# Altium project SL-DPT100.PrjPcb
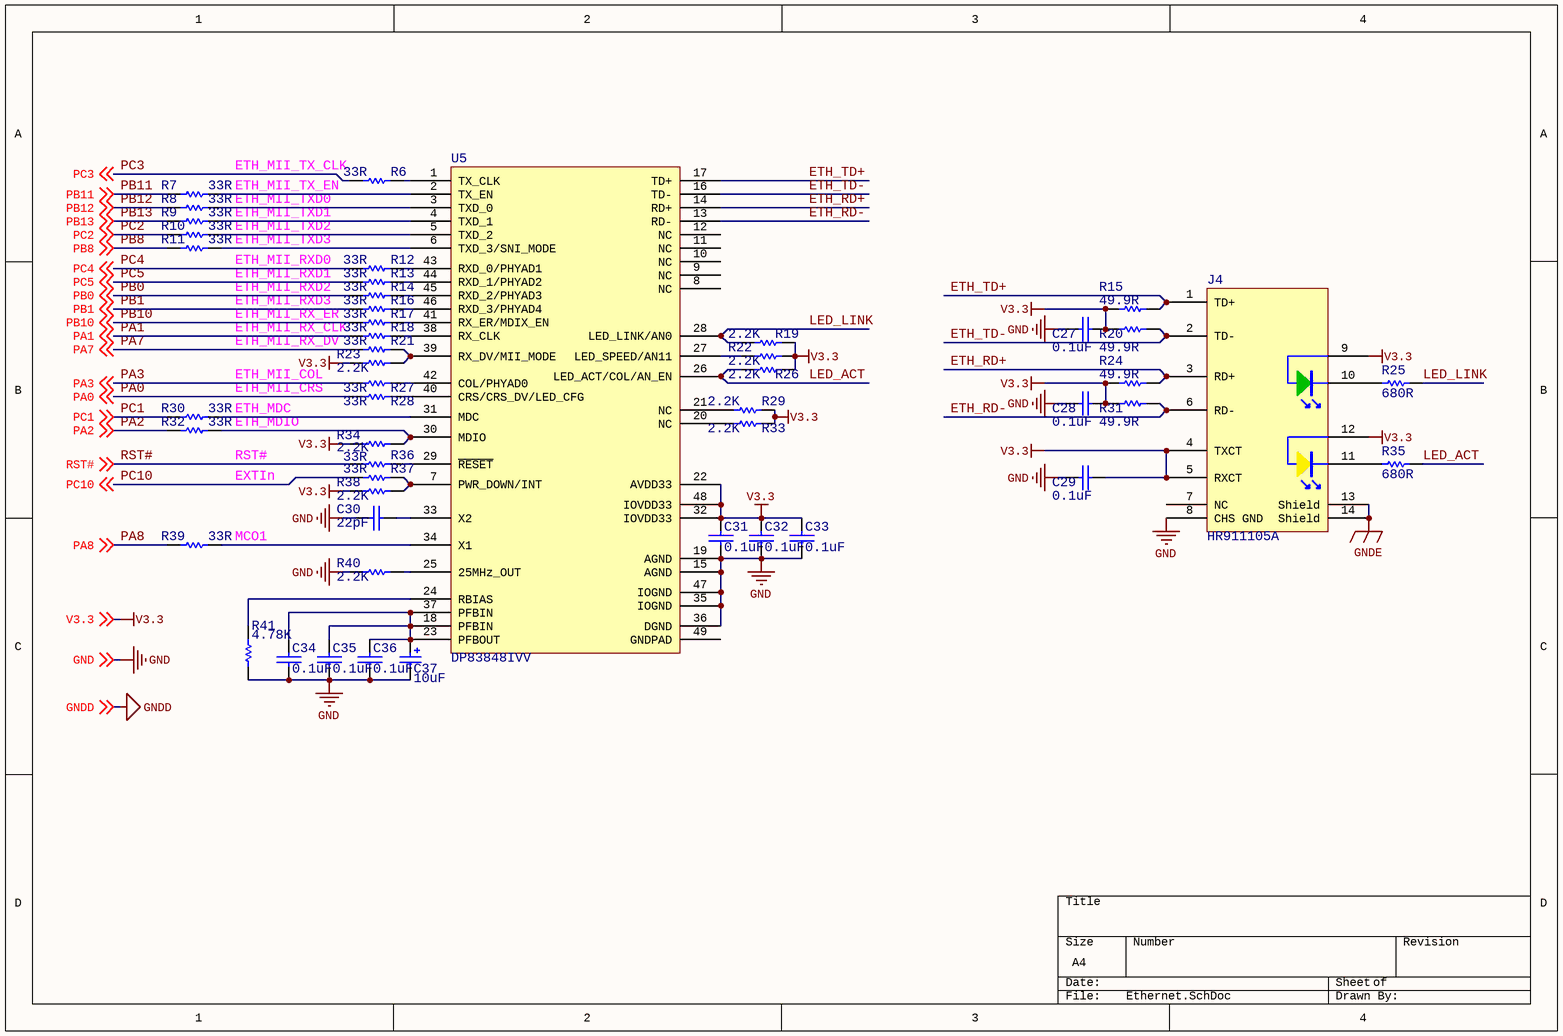
[diagram p0: Ethernet.SchDoc]
4 sheets, 177 parts. Net scope: global (net labels, ports and power ports of the same name join across sheets).
Board files: SL-DPT100.PcbDoc, Phoenix ME MAX 22.5 2-2 KMGY.PcbDoc
Sheets:
  Ethernet.SchDoc
  MCU.SchDoc
  MCU_1.SchDoc
  Power.SchDoc

## Sheet Ethernet.SchDoc
size A4; PageSetup: Record=PageOptions|CenterHorizontal=True|CenterVertical=True|PrintScale=0.98|XCorrection=1.00|YCorrection=1.00|PrintKind=0|BorderSize=5000000|LeftOffset=0|BottomOffset=0|Orientation=2|PaperLength=1000|PaperWidth=1000|Scale=100|PaperSource=7|PrintQuality=-4|MediaType=1|DitherType=10|PaperKind=A4 210x297 ºÁÃ×|PrintScaleMode=1

### Parts
C27  0.1uF  [C1608(0603)]
C28  0.1uF  [C1608(0603)]
C29  0.1uF  [C1608(0603)]
C30  22pF  [C1608(0603)]
C31  0.1uF  [C1608(0603)]
C32  0.1uF  [C1608(0603)]
C33  0.1uF  [C1608(0603)]
C34  0.1uF  [C1608(0603)]
C35  0.1uF  [C1608(0603)]
C36  0.1uF  [C1608(0603)]
C37  10uF  [C2012(0805)]
J4  HR911105A  [RJ45-LED]
R6  33R  [R1608(0603)]
R7  33R  [R1608(0603)]
R8  33R  [R1608(0603)]
R9  33R  [R1608(0603)]
R10  33R  [R1608(0603)]
R11  33R  [R1608(0603)]
R12  33R  [R1608(0603)]
R13  33R  [R1608(0603)]
R14  33R  [R1608(0603)]
R15  49.9R  [R1608(0603)]
R16  33R  [R1608(0603)]
R17  33R  [R1608(0603)]
R18  33R  [R1608(0603)]
R19  2.2K  [R1608(0603)]
R20  49.9R  [R1608(0603)]
R21  33R  [R1608(0603)]
R22  2.2K  [R1608(0603)]
R23  2.2K  [R1608(0603)]
R24  49.9R  [R1608(0603)]
R25  680R  [R1608(0603)]
R26  2.2K  [R1608(0603)]
R27  33R  [R1608(0603)]
R28  33R  [R1608(0603)]
R29  2.2K  [R1608(0603)]
R30  33R  [R1608(0603)]
R31  49.9R  [R1608(0603)]
R32  33R  [R1608(0603)]
R33  2.2K  [R1608(0603)]
R34  2.2K  [R1608(0603)]
R35  680R  [R1608(0603)]
R36  33R  [R1608(0603)]
R37  33R  [R1608(0603)]
R38  2.2K  [R1608(0603)]
R39  33R  [R1608(0603)]
R40  2.2K  [R1608(0603)]
R41  4.78K  [R1608(0603)]
U5  DP83848IVV  [LQFP48_M]

### Nets
GND: C27.2 C28.2 C29.2 C30.1 C31.1 C32.1 C33.1 C34.1 C35.1 C36.1 C37.2 J4.8(CHS_GND) R40.2 R41.2 U5.15(AGND) U5.19(AGND) U5.35(IOGND) U5.36(DGND) U5.47(IOGND) ; off-sheet GND
GNDE: J4.13(Shield) J4.14(Shield)
V3.3: C27.1 C28.1 C29.1 C31.2 C32.2 C33.2 J4.4(TXCT) J4.5(RXCT) J4.9 J4.12 R15.2 R19.1 R20.2 R22.1 R23.2 R24.2 R26.1 R29.1 R31.2 R33.1 R34.2 R38.2 U5.22(AVDD33) U5.32(IOVDD33) U5.48(IOVDD33) ; off-sheet V3.3
ETH_RD+: J4.3(RD+) R24.1 U5.14(RD+)
ETH_RD-: J4.6(RD-) R31.1 U5.13(RD-)
ETH_TD+: J4.1(TD+) R15.1 U5.17(TD+)
ETH_TD-: J4.2(TD-) R20.1 U5.16(TD-)
LED_ACT: R26.2 R35.2 U5.26(LED_ACT/COL/AN_EN)
LED_LINK: R19.2 R25.2 U5.28(LED_LINK/AN0)
PA0: R28.2 ; off-sheet PA0
PA1: R18.2 ; off-sheet PA1
PA2: R32.2 ; off-sheet PA2
PA3: R27.2 ; off-sheet PA3
PA7: R21.2 ; off-sheet PA7
PA8: R39.2 ; off-sheet PA8
PB0: R14.2 ; off-sheet PB0
PB1: R16.2 ; off-sheet PB1
PB8: R11.2 ; off-sheet PB8
PB10: R17.2 ; off-sheet PB10
PB11: R7.2 ; off-sheet PB11
PB12: R8.2 ; off-sheet PB12
PB13: R9.2 ; off-sheet PB13
PC1: R30.2 ; off-sheet PC1
PC2: R10.2 ; off-sheet PC2
PC3: R6.2 ; off-sheet PC3
PC4: R12.2 ; off-sheet PC4
PC5: R13.2 ; off-sheet PC5
PC10: R37.2 ; off-sheet PC10
RST#: R36.2 ; off-sheet RST#
NetC30_2: C30.2 U5.33(X2)
NetC34_2: C34.2 C35.2 C36.2 C37.1 U5.18(PFBIN) U5.23(PFBOUT) U5.37(PFBIN)
NetJ4_10: J4.10 R25.1
NetJ4_11: J4.11 R35.1
NetR6_1: R6.1 U5.1(TX_CLK)
NetR7_1: R7.1 U5.2(TX_EN)
NetR8_1: R8.1 U5.3(TXD_0)
NetR9_1: R9.1 U5.4(TXD_1)
NetR10_1: R10.1 U5.5(TXD_2)
NetR11_1: R11.1 U5.6(TXD_3/SNI_MODE)
NetR12_1: R12.1 U5.43(RXD_0/PHYAD1)
NetR13_1: R13.1 U5.44(RXD_1/PHYAD2)
NetR14_1: R14.1 U5.45(RXD_2/PHYAD3)
NetR16_1: R16.1 U5.46(RXD_3/PHYAD4)
NetR17_1: R17.1 U5.41(RX_ER/MDIX_EN)
NetR18_1: R18.1 U5.38(RX_CLK)
NetR21_1: R21.1 R23.1 U5.39(RX_DV/MII_MODE)
NetR22_2: R22.2 U5.27(LED_SPEED/AN11)
NetR27_1: R27.1 U5.42(COL/PHYAD0)
NetR28_1: R28.1 U5.40(CRS/CRS_DV/LED_CFG)
NetR29_2: R29.2 U5.21(NC)
NetR30_1: R30.1 U5.31(MDC)
NetR32_1: R32.1 R34.1 U5.30(MDIO)
NetR33_2: R33.2 U5.20(NC)
NetR36_1: R36.1 U5.29(~{RESET})
NetR37_1: R37.1 R38.1 U5.7(PWR_DOWN/INT)
NetR39_1: R39.1 U5.34(X1)
NetR40_1: R40.1 U5.25(25MHz_OUT)
NetR41_1: R41.1 U5.24(RBIAS)

Not connected (* = marked no-connect by the designer): J4 7(NC); U5 8(NC) 9(NC) 10(NC) 11(NC) 12(NC) 49(GNDPAD)

### Notes on the sheet
- ETH_MII_TX_CLK
- ETH_MII_TX_EN
- ETH_MII_TXD0
- ETH_MII_TXD1
- ETH_MII_TXD2
- ETH_MII_TXD3
- ETH_MII_RXD0
- ETH_MII_RXD1
- ETH_MII_RXD2
- ETH_MII_RXD3
- ETH_MII_RX_ER
- ETH_MII_RX_DV
- ETH_MII_RX_CLK
- ETH_MII_COL
- ETH_MII_CRS
- ETH_MDC
- ETH_MDIO
- RST#
- EXTIn
- (near R39) MCO1

### Library data of the parts
C27-C36 = CAP: Capacitor
C37 = Cap Pol2: Polarized Capacitor (Axial); Value: 100pF/100V; Published: 8-Jun-2000; LatestRevisionDate: 17-Jul-2002; LatestRevisionNote: Re-released for DXP Platform.; PackageReference: POLAR0.8; Publisher: Altium Limited
R6-R41 = Res Semi: Semiconductor Resistor; Value: 1K; Published: 8-Jun-2000; LatestRevisionDate: 17-Jul-2002; LatestRevisionNote: Re-released for DXP Platform.; PackageReference: AXIAL-0.5; Publisher: Altium Limited
U5 = DP83848CVV

## Sheet MCU.SchDoc
size A4; PageSetup: Record=PageOptions|CenterHorizontal=True|CenterVertical=True|PrintScale=0.98|XCorrection=1.00|YCorrection=1.00|PrintKind=0|BorderSize=5000000|LeftOffset=0|BottomOffset=0|Orientation=2|PaperLength=1000|PaperWidth=1000|Scale=100|PaperSource=7|PrintQuality=-4|MediaType=1|DitherType=10|PaperKind=A4 210x297 ºÁÃ×|PrintScaleMode=1
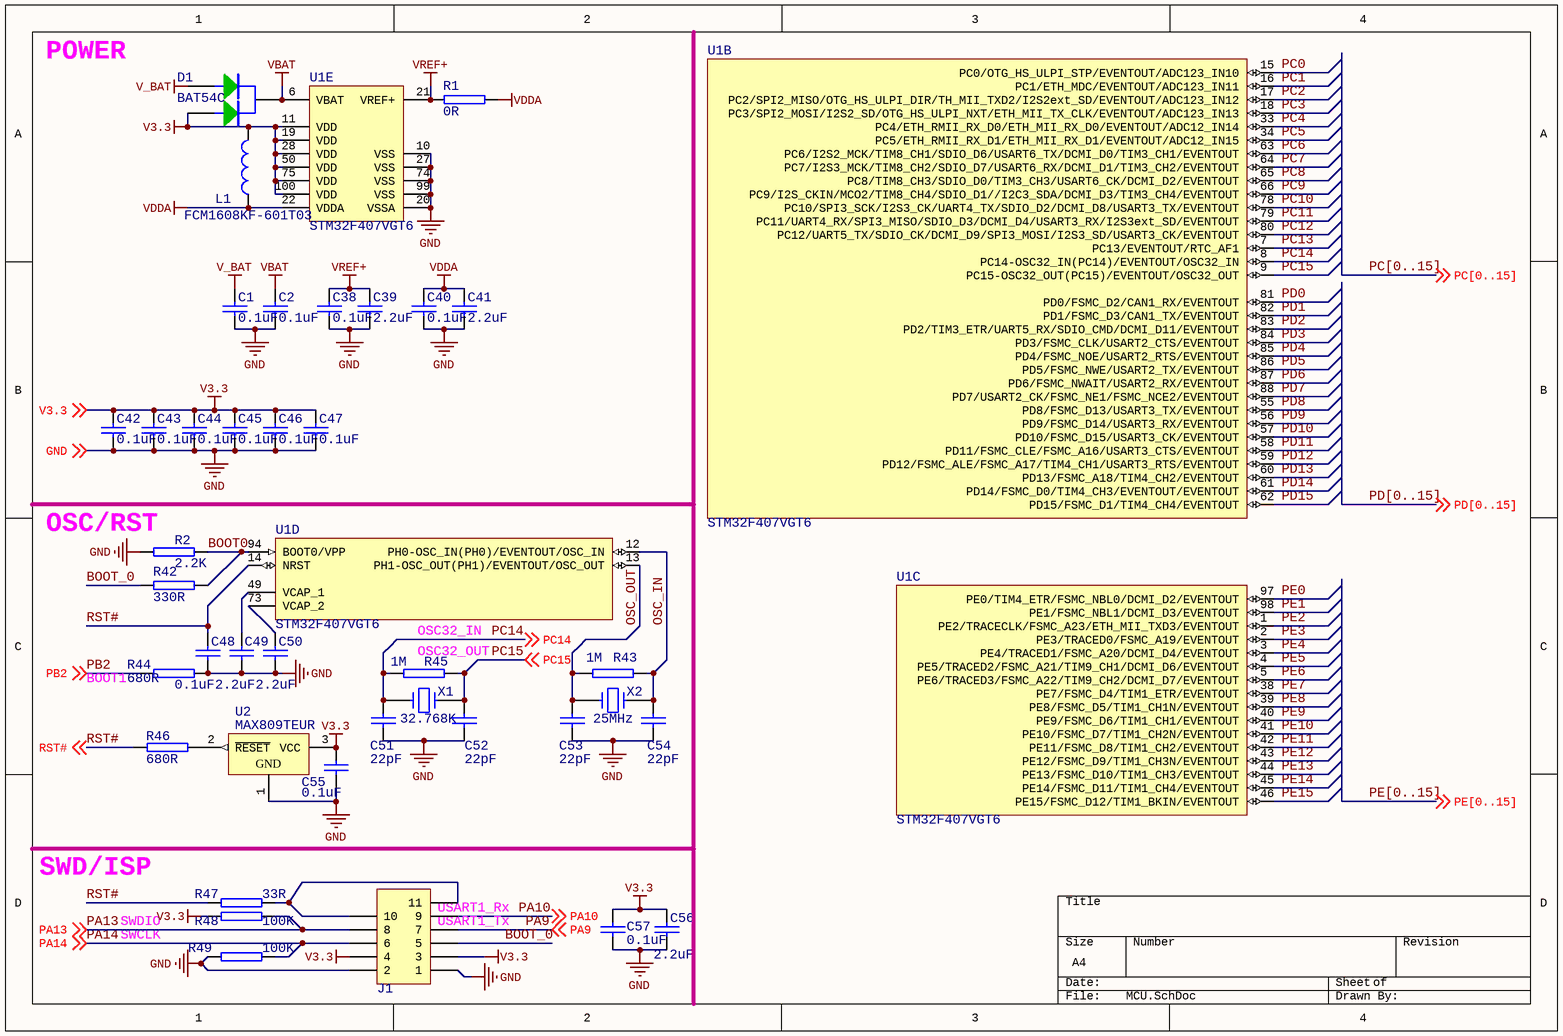
[diagram p1: MCU.SchDoc]

### Parts
C1  0.1uF  [C1608(0603)]
C2  0.1uF  [C1608(0603)]
C38  0.1uF  [C1608(0603)]
C39  2.2uF  [C1608(0603)]
C40  0.1uF  [C1608(0603)]
C41  2.2uF  [C1608(0603)]
C42  0.1uF  [C1608(0603)]
C43  0.1uF  [C1608(0603)]
C44  0.1uF  [C1608(0603)]
C45  0.1uF  [C1608(0603)]
C46  0.1uF  [C1608(0603)]
C47  0.1uF  [C1608(0603)]
C48  0.1uF  [C1608(0603)]
C49  2.2uF  [C1608(0603)]
C50  2.2uF  [C1608(0603)]
C51  22pF  [C1608(0603)]
C52  22pF  [C1608(0603)]
C53  22pF  [C1608(0603)]
C54  22pF  [C1608(0603)]
C55  0.1uF  [C1608(0603)]
C56  2.2uF  [C1608(0603)]
C57  0.1uF  [C1608(0603)]
D1  BAT54C  [SOT23-3_N]
J1  H2.54 6X2  [HDR2X6H]  (value not drawn)
L1  FCM1608KF-601T03  [R1608(0603)]
R1  0R  [R1608(0603)]
R2  2.2K  [R1608(0603)]
R42  330R  [R1608(0603)]
R43  1M  [R1608(0603)]
R44  680R  [R1608(0603)]
R45  1M  [R1608(0603)]
R46  680R  [R1608(0603)]
R47  33R  [R1608(0603)]
R48  100K  [R1608(0603)]
R49  100K  [R1608(0603)]
U1  STM32F407VGT6  [TQFP100_N]  (parts B,C,D,E of 5)
U2  MAX809TEUR  [SOT23-3_N]
X1  32.768K  [FC-135]
X2  25MHz  [XTAL-3225]

### Nets
GND: C1.2 C2.2 C38.2 C39.2 C40.2 C41.2 C42.2 C43.2 C44.2 C45.2 C46.2 C47.2 C48.2 C49.2 C50.2 C51.1 C52.1 C53.1 C54.1 C55.2 C56.2 C57.1 J1.1 J1.2 R2.2 R44.1 R49.1 U1.10(VSS) U1.20(VSSA) U1.27(VSS) U1.74(VSS) U1.99(VSS) U2.1(GND) ; off-sheet GND
V3.3: C42.1 C43.1 C44.1 C45.1 C46.1 C47.1 C55.1 C56.1 C57.2 D1.1 J1.3 J1.4 L1.2 R48.1 U1.11(VDD) U1.19(VDD) U1.28(VDD) U1.50(VDD) U1.75(VDD) U1.100(VDD) U2.3(VCC) ; off-sheet V3.3
V_BAT: C1.1 D1.2
VBAT: C2.1 D1.3 U1.6(VBAT)
VDDA: C40.1 C41.1 L1.1 R1.1 U1.22(VDDA)
VREF+: C38.1 C39.1 R1.2 U1.21(VREF+)
BOOT0: R2.1 R42.2 U1.94(BOOT0/VPP)
BOOT_0: J1.5 R42.1
OSC_IN: C54.2 R43.1 U1.12(PH0-OSC_IN(PH0)/EVENTOUT/OSC_IN) X2.1
OSC_OUT: C53.2 R43.2 U1.13(PH1-OSC_OUT(PH1)/EVENTOUT/OSC_OUT) X2.3
PA9: J1.7 ; off-sheet PA9
PA10: J1.9 ; off-sheet PA10
PA13: J1.8 R48.2 ; off-sheet PA13
PA14: J1.6 R49.2 ; off-sheet PA14
PB2: R44.2 ; off-sheet PB2
PC0: U1.15(PC0/OTG_HS_ULPI_STP/EVENTOUT/ADC123_IN10)
PC1: U1.16(PC1/ETH_MDC/EVENTOUT/ADC123_IN11)
PC2: U1.17(PC2/SPI2_MISO/OTG_HS_ULPI_DIR/TH_MII_TXD2/I2S2ext_SD/EVENTOUT/ADC123_IN12)
PC3: U1.18(PC3/SPI2_MOSI/I2S2_SD/OTG_HS_ULPI_NXT/ETH_MII_TX_CLK/EVENTOUT/ADC123_IN13)
PC4: U1.33(PC4/ETH_RMII_RX_D0/ETH_MII_RX_D0/EVENTOUT/ADC12_IN14)
PC5: U1.34(PC5/ETH_RMII_RX_D1/ETH_MII_RX_D1/EVENTOUT/ADC12_IN15)
PC6: U1.63(PC6/I2S2_MCK/TIM8_CH1/SDIO_D6/USART6_TX/DCMI_D0/TIM3_CH1/EVENTOUT)
PC7: U1.64(PC7/I2S3_MCK/TIM8_CH2/SDIO_D7/USART6_RX/DCMI_D1/TIM3_CH2/EVENTOUT)
PC8: U1.65(PC8/TIM8_CH3/SDIO_D0/TIM3_CH3/USART6_CK/DCMI_D2/EVENTOUT)
PC9: U1.66(PC9/I2S_CKIN/MCO2/TIM8_CH4/SDIO_D1//I2C3_SDA/DCMI_D3/TIM3_CH4/EVENTOUT)
PC10: U1.78(PC10/SPI3_SCK/I2S3_CK/UART4_TX/SDIO_D2/DCMI_D8/USART3_TX/EVENTOUT)
PC11: U1.79(PC11/UART4_RX/SPI3_MISO/SDIO_D3/DCMI_D4/USART3_RX/I2S3ext_SD/EVENTOUT)
PC12: U1.80(PC12/UART5_TX/SDIO_CK/DCMI_D9/SPI3_MOSI/I2S3_SD/USART3_CK/EVENTOUT)
PC13: U1.7(PC13/EVENTOUT/RTC_AF1)
PC14: C51.2 R45.2 U1.8(PC14-OSC32_IN(PC14)/EVENTOUT/OSC32_IN) X1.2 ; off-sheet PC14
PC15: C52.2 R45.1 U1.9(PC15-OSC32_OUT(PC15)/EVENTOUT/OSC32_OUT) X1.1 ; off-sheet PC15
PD0: U1.81(PD0/FSMC_D2/CAN1_RX/EVENTOUT)
PD1: U1.82(PD1/FSMC_D3/CAN1_TX/EVENTOUT)
PD2: U1.83(PD2/TIM3_ETR/UART5_RX/SDIO_CMD/DCMI_D11/EVENTOUT)
PD3: U1.84(PD3/FSMC_CLK/USART2_CTS/EVENTOUT)
PD4: U1.85(PD4/FSMC_NOE/USART2_RTS/EVENTOUT)
PD5: U1.86(PD5/FSMC_NWE/USART2_TX/EVENTOUT)
PD6: U1.87(PD6/FSMC_NWAIT/USART2_RX/EVENTOUT)
PD7: U1.88(PD7/USART2_CK/FSMC_NE1/FSMC_NCE2/EVENTOUT)
PD8: U1.55(PD8/FSMC_D13/USART3_TX/EVENTOUT)
PD9: U1.56(PD9/FSMC_D14/USART3_RX/EVENTOUT)
PD10: U1.57(PD10/FSMC_D15/USART3_CK/EVENTOUT)
PD11: U1.58(PD11/FSMC_CLE/FSMC_A16/USART3_CTS/EVENTOUT)
PD12: U1.59(PD12/FSMC_ALE/FSMC_A17/TIM4_CH1/USART3_RTS/EVENTOUT)
PD13: U1.60(PD13/FSMC_A18/TIM4_CH2/EVENTOUT)
PD14: U1.61(PD14/FSMC_D0/TIM4_CH3/EVENTOUT/EVENTOUT)
PD15: U1.62(PD15/FSMC_D1/TIM4_CH4/EVENTOUT)
PE0: U1.97(PE0/TIM4_ETR/FSMC_NBL0/DCMI_D2/EVENTOUT)
PE1: U1.98(PE1/FSMC_NBL1/DCMI_D3/EVENTOUT)
PE2: U1.1(PE2/TRACECLK/FSMC_A23/ETH_MII_TXD3/EVENTOUT)
PE3: U1.2(PE3/TRACED0/FSMC_A19/EVENTOUT)
PE4: U1.3(PE4/TRACED1/FSMC_A20/DCMI_D4/EVENTOUT)
PE5: U1.4(PE5/TRACED2/FSMC_A21/TIM9_CH1/DCMI_D6/EVENTOUT)
PE6: U1.5(PE6/TRACED3/FSMC_A22/TIM9_CH2/DCMI_D7/EVENTOUT)
PE7: U1.38(PE7/FSMC_D4/TIM1_ETR/EVENTOUT)
PE8: U1.39(PE8/FSMC_D5/TIM1_CH1N/EVENTOUT)
PE9: U1.40(PE9/FSMC_D6/TIM1_CH1/EVENTOUT)
PE10: U1.41(PE10/FSMC_D7/TIM1_CH2N/EVENTOUT)
PE11: U1.42(PE11/FSMC_D8/TIM1_CH2/EVENTOUT)
PE12: U1.43(PE12/FSMC_D9/TIM1_CH3N/EVENTOUT)
PE13: U1.44(PE13/FSMC_D10/TIM1_CH3/EVENTOUT)
PE14: U1.45(PE14/FSMC_D11/TIM1_CH4/EVENTOUT)
PE15: U1.46(PE15/FSMC_D12/TIM1_BKIN/EVENTOUT)
RST#: C48.1 R46.1 R47.2 U1.14(NRST) ; off-sheet RST#
NetC49_1: C49.1 U1.49(VCAP_1)
NetC50_1: C50.1 U1.73(VCAP_2)
NetJ1_10: J1.10 J1.11 R47.1
NetR46_2: R46.2 U2.2(~{RESET})

### Buses and harness runs
bus PC[0..15]
bus PD[0..15]
bus PE[0..15]

### Notes on the sheet
- POWER
- (near R2) OSC/RST
- (near U1) OSC32_IN
- (near R45) OSC32_OUT
- (near R44) BOOT1
- SWD/ISP
- SWDIO
- (near J1) USART1_Tx
- (near J1) USART1_Rx
- SWCLK

### Library data of the parts
C1 C2 C38-C57 = CAP: Capacitor
J1 = Header 6X2: Header, 6-Pin, Dual row; LatestRevisionDate: 17-Jul-2002; LatestRevisionNote: Re-released for DXP Platform.; Publisher: Altium Limited
L1 = Inductor: Code_IEC: 1005; Value: 10mH; Published: 8-Jun-2000; LatestRevisionDate: 29-May-2009; LatestRevisionNote: IPC-7351 Footprint Added.; PackageReference: 0402-A; Publisher: Altium Limited; PackageDescription: Chip Inductor; Code_JEITA: 0402
R1 R2 R42-R49 = R
U1 = STM32F407VGT6: ARM Cortex-M4 32b MCU+FPU, 210DMIP, 1024 kB Flash, 192+4 kB RAM, Camera, 82 I/Os, 100-pin LQFP, -40 to +85°C, Tray; Internal RAM: 192kB; Operating Frequency (Processor Speed): 168MHz; A/D Converter: 16x12-bit; D/A Converter: 2x12-bit; 16-bit Timers (IC/OC/PWM): 12x16-bit(24/24/30); 32-bit Timer (IC/OC/PWM): 2x32-bit (8/8/8); Other Timer Functions: 2xWDG, RTC, 24-bit down counter; Serial Interface: 3xSPI/2xI2S/2xI2C/3xUSART(IrDa, ISO7816)/3xUART/2xUSB OTG FS/HS, 2xCAN/Ethernet MAC10/100, SDIO; DatasheetVersion: rev2, Jan-2012; PackageVersion: 2012; PackageReference: LQFP100; PackageDescription: 100-Pin Low Profile Quad Flat Package, 14x14 mm Body, 0.5 mm Pitch; ComponentLink1Description: Manufacturer URL; ComponentLink1URL: http://www.st.com/; ComponentLink2Description: STM32F405/7 Datasheet; ComponentLink2URL: http://www.st.com/internet/com/TECHNICAL_RESOURCES/TECHNICAL_LITERATURE/DATASHEET/DM00037051.pdf; ComponentLink3Description: STM32F4 Web Page; ComponentLink3URL: http://www.st.com/internet/mcu/subclass/1521.jsp
U2 = MAX6520EUR-T: 3-Terminal, 1.2V Voltage Reference; Published: 16-Jan-2001; LatestRevisionDate: 29-May-2009; LatestRevisionNote: IPC-7351 Footprint Added.; DatasheetVersion: Sep-1996; PackageVersion: 1996; PackageReference: SOT23-3; Publisher: Altium Limited; PackageDescription: 3-Pin SOT-23 Package 0.95 mm Pitch, 2.3 mm Lead Span; ComponentLink1Description: Manufacturer Link; ComponentLink1URL: http://www.maxim-ic.com/; ComponentLink2Description: Datasheet; ComponentLink2URL: http://pdfserv.maxim-ic.com/en/ds/MAX6520.pdf
X1 X2 = CRYSTAL

## Sheet MCU_1.SchDoc
size A4; PageSetup: Record=PageOptions|CenterHorizontal=True|CenterVertical=True|PrintScale=0.98|XCorrection=1.00|YCorrection=1.00|PrintKind=0|BorderSize=5000000|LeftOffset=0|BottomOffset=0|Orientation=2|PaperLength=1000|PaperWidth=1000|Scale=100|PaperSource=7|PrintQuality=-4|MediaType=1|DitherType=10|PaperKind=A4 210x297 ºÁÃ×|PrintScaleMode=1
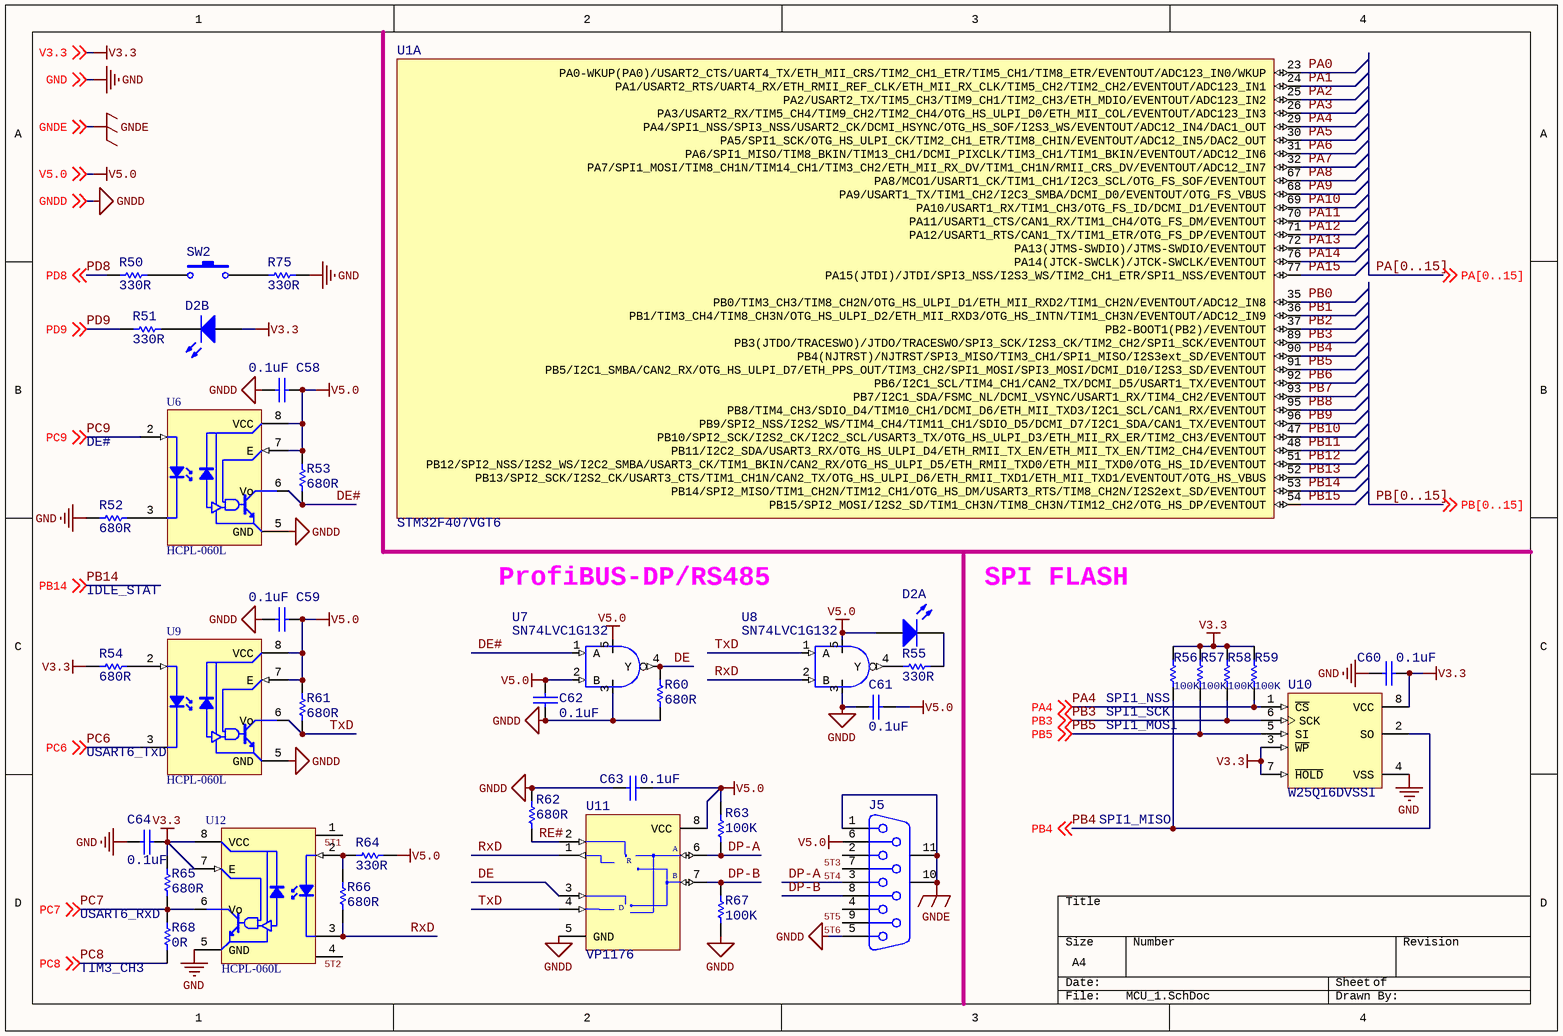
[diagram p2: MCU_1.SchDoc]

### Parts
C58  0.1uF  [C1608(0603)]
C59  0.1uF  [C1608(0603)]
C60  0.1uF  [C1608(0603)]
C61  0.1uF  [C1608(0603)]
C62  0.1uF  [C1608(0603)]
C63  0.1uF  [C1608(0603)]
C64  0.1uF  [C1608(0603)]
D2  LED-2  [LED-2]  (value not drawn)  (parts A,B of 2)
J5  D Connector 9  [DB9F]  (value not drawn)
R50  330R  [R1608(0603)]
R51  330R  [R1608(0603)]
R52  680R  [R1608(0603)]
R53  680R  [R1608(0603)]
R54  680R  [R1608(0603)]
R55  330R  [R1608(0603)]
R56  100K  [R1608(0603)]
R57  100K  [R1608(0603)]
R58  100K  [R1608(0603)]
R59  100K  [R1608(0603)]
R60  680R  [R1608(0603)]
R61  680R  [R1608(0603)]
R62  680R  [R1608(0603)]
R63  100K  [R1608(0603)]
R64  330R  [R1608(0603)]
R65  680R  [R1608(0603)]
R66  680R  [R1608(0603)]
R67  100K  [R1608(0603)]
R68  0R  [R1608(0603)]
R75  330R  [R1608(0603)]
SW2  SW-PB  [KEY 4.5x4.5x4.3mm]  (value not drawn)
U1  STM32F407VGT6  [TQFP100_N]  (part A of 5)
U6  HCPL-060L  [SO8_M]
U7  SN74LVC1G132  [SOT23-5_N]
U8  SN74LVC1G132  [SOT23-5_N]
U9  HCPL-060L  [SO8_M]
U10  W25Q16DVSSI  [SOIC8_M]
U11  VP1176  [SO8_M]
U12  HCPL-060L  [SO8_M]

### Nets
GND: C60.2 C64.2 R52.1 R75.2 U10.4(VSS) U12.5(GND) ; off-sheet GND
GNDD: C58.2 C59.2 C61.1 C62.2 C63.2 J5.5 R60.1 R62.2 R67.1 U6.5(GND) U7.3(GND) U8.3(GND) U9.5(GND) U11.5(GND) ; off-sheet GNDD
GNDE: J5.1 J5.10(MH1) J5.11(MH2) ; off-sheet GNDE
V3.3: C60.1 C64.1 D2.3(A2) R54.1 R56.2 R57.2 R58.2 R59.2 R65.2 U10.3(~{WP}) U10.7(~{HOLD}) U10.8(VCC) U12.7(E) U12.8(VCC) ; off-sheet V3.3
V5.0: C58.1 C59.1 C61.2 C62.1 C63.1 D2.1(A1) J5.6 R53.2 R61.2 R63.2 R64.2 U6.7(E) U6.8(VCC) U7.2(B) U7.5(VCC) U8.5(VCC) U9.7(E) U9.8(VCC) U11.8(VCC) ; off-sheet V5.0
5T1: U12.1
5T2: U12.4
5T3: J5.2
5T4: J5.7
5T5: J5.4
5T6: J5.9
DE: R60.2 U7.4(Y) U11.3(DE)
DE#: R53.1 U6.6(Vo) U7.1(A)
DP-A: J5.3 R63.1 U11.6(A)
DP-B: J5.8 R67.2 U11.7(B)
PA0: U1.23(PA0-WKUP(PA0)/USART2_CTS/UART4_TX/ETH_MII_CRS/TIM2_CH1_ETR/TIM5_CH1/TIM8_ETR/EVENTOUT/ADC123_IN0/WKUP)
PA1: U1.24(PA1/USART2_RTS/UART4_RX/ETH_RMII_REF_CLK/ETH_MII_RX_CLK/TIM5_CH2/TIM2_CH2/EVENTOUT/ADC123_IN1)
PA2: U1.25(PA2/USART2_TX/TIM5_CH3/TIM9_CH1/TIM2_CH3/ETH_MDIO/EVENTOUT/ADC123_IN2)
PA3: U1.26(PA3/USART2_RX/TIM5_CH4/TIM9_CH2/TIM2_CH4/OTG_HS_ULPI_D0/ETH_MII_COL/EVENTOUT/ADC123_IN3)
PA4: R59.1 U1.29(PA4/SPI1_NSS/SPI3_NSS/USART2_CK/DCMI_HSYNC/OTG_HS_SOF/I2S3_WS/EVENTOUT/ADC12_IN4/DAC1_OUT) U10.1(~{CS}) ; off-sheet PA4
PA5: U1.30(PA5/SPI1_SCK/OTG_HS_ULPI_CK/TIM2_CH1_ETR/TIM8_CHIN/EVENTOUT/ADC12_IN5/DAC2_OUT)
PA6: U1.31(PA6/SPI1_MISO/TIM8_BKIN/TIM13_CH1/DCMI_PIXCLK/TIM3_CH1/TIM1_BKIN/EVENTOUT/ADC12_IN6)
PA7: U1.32(PA7/SPI1_MOSI/TIM8_CH1N/TIM14_CH1/TIM3_CH2/ETH_MII_RX_DV/TIM1_CH1N/RMII_CRS_DV/EVENTOUT/ADC12_IN7)
PA8: U1.67(PA8/MCO1/USART1_CK/TIM1_CH1/I2C3_SCL/OTG_FS_SOF/EVENTOUT)
PA9: U1.68(PA9/USART1_TX/TIM1_CH2/I2C3_SMBA/DCMI_D0/EVENTOUT/OTG_FS_VBUS)
PA10: U1.69(PA10/USART1_RX/TIM1_CH3/OTG_FS_ID/DCMI_D1/EVENTOUT)
PA11: U1.70(PA11/USART1_CTS/CAN1_RX/TIM1_CH4/OTG_FS_DM/EVENTOUT)
PA12: U1.71(PA12/USART1_RTS/CAN1_TX/TIM1_ETR/OTG_FS_DP/EVENTOUT)
PA13: U1.72(PA13(JTMS-SWDIO)/JTMS-SWDIO/EVENTOUT)
PA14: U1.76(PA14(JTCK-SWCLK)/JTCK-SWCLK/EVENTOUT)
PA15: U1.77(PA15(JTDI)/JTDI/SPI3_NSS/I2S3_WS/TIM2_CH1_ETR/SPI1_NSS/EVENTOUT)
PB0: U1.35(PB0/TIM3_CH3/TIM8_CH2N/OTG_HS_ULPI_D1/ETH_MII_RXD2/TIM1_CH2N/EVENTOUT/ADC12_IN8)
PB1: U1.36(PB1/TIM3_CH4/TIM8_CH3N/OTG_HS_ULPI_D2/ETH_MII_RXD3/OTG_HS_INTN/TIM1_CH3N/EVENTOUT/ADC12_IN9)
PB2: U1.37(PB2-BOOT1(PB2)/EVENTOUT)
PB3: R58.1 U1.89(PB3(JTDO/TRACESWO)/JTDO/TRACESWO/SPI3_SCK/I2S3_CK/TIM2_CH2/SPI1_SCK/EVENTOUT) U10.6(SCK) ; off-sheet PB3
PB4: R56.1 U1.90(PB4(NJTRST)/NJTRST/SPI3_MISO/TIM3_CH1/SPI1_MISO/I2S3ext_SD/EVENTOUT) U10.2(SO) ; off-sheet PB4
PB5: R57.1 U1.91(PB5/I2C1_SMBA/CAN2_RX/OTG_HS_ULPI_D7/ETH_PPS_OUT/TIM3_CH2/SPI1_MOSI/SPI3_MOSI/DCMI_D10/I2S3_SD/EVENTOUT) U10.5(SI) ; off-sheet PB5
PB6: U1.92(PB6/I2C1_SCL/TIM4_CH1/CAN2_TX/DCMI_D5/USART1_TX/EVENTOUT)
PB7: U1.93(PB7/I2C1_SDA/FSMC_NL/DCMI_VSYNC/USART1_RX/TIM4_CH2/EVENTOUT)
PB8: U1.95(PB8/TIM4_CH3/SDIO_D4/TIM10_CH1/DCMI_D6/ETH_MII_TXD3/I2C1_SCL/CAN1_RX/EVENTOUT)
PB9: U1.96(PB9/SPI2_NSS/I2S2_WS/TIM4_CH4/TIM11_CH1/SDIO_D5/DCMI_D7/I2C1_SDA/CAN1_TX/EVENTOUT)
PB10: U1.47(PB10/SPI2_SCK/I2S2_CK/I2C2_SCL/USART3_TX/OTG_HS_ULPI_D3/ETH_MII_RX_ER/TIM2_CH3/EVENTOUT)
PB11: U1.48(PB11/I2C2_SDA/USART3_RX/OTG_HS_ULPI_D4/ETH_RMII_TX_EN/ETH_MII_TX_EN/TIM2_CH4/EVENTOUT)
PB12: U1.51(PB12/SPI2_NSS/I2S2_WS/I2C2_SMBA/USART3_CK/TIM1_BKIN/CAN2_RX/OTG_HS_ULPI_D5/ETH_RMII_TXD0/ETH_MII_TXD0/OTG_HS_ID/EVENTOUT)
PB13: U1.52(PB13/SPI2_SCK/I2S2_CK/USART3_CTS/TIM1_CH1N/CAN2_TX/OTG_HS_ULPI_D6/ETH_RMII_TXD1/ETH_MII_TXD1/EVENTOUT/OTG_HS_VBUS)
PB14: U1.53(PB14/SPI2_MISO/TIM1_CH2N/TIM12_CH1/OTG_HS_DM/USART3_RTS/TIM8_CH2N/I2S2ext_SD/EVENTOUT) ; off-sheet PB14
PB15: U1.54(PB15/SPI2_MOSI/I2S2_SD/TIM1_CH3N/TIM8_CH3N/TIM12_CH2/OTG_HS_DP/EVENTOUT)
PC6: U9.3(-) ; off-sheet PC6
PC7: R65.1 R68.2 U12.6(Vo) ; off-sheet PC7
PC8: R68.1 ; off-sheet PC8
PC9: U6.2(+) ; off-sheet PC9
PD8: R50.1 ; off-sheet PD8
PD9: R51.1 ; off-sheet PD9
RE#: R62.1 U11.2(~{RE})
RxD: R66.1 U8.2(B) U11.1(RO) U12.3(-)
TxD: R61.1 U8.1(A) U9.6(Vo) U11.4(DI)
NetD2_2: D2.2(K1) R55.2
NetD2_4: D2.4(K2) R51.2
NetR50_2: R50.2 SW2.1
NetR52_2: R52.2 U6.3(-)
NetR54_2: R54.2 U9.2(+)
NetR55_1: R55.1 U8.4(Y)
NetR64_1: R64.1 R66.2 U12.2(+)
NetR75_1: R75.1 SW2.2

Not connected (* = marked no-connect by the designer): U6 1 4; U9 1 4

### Buses and harness runs
bus PA[0..15]
bus PB[0..15]

### Notes on the sheet
- DE#
- IDLE_STAT
- ProfiBUS-DP/RS485
- SPI FLASH
- (near R56) SPI1_NSS
- (near R56) SPI1_SCK
- (near U9) USART6_TxD
- SPI1_MOSI
- SPI1_MISO
- USART6_RxD
- (near R68) TIM3_CH3
- (in symbol MAX485ESA) R; D

### Library data of the parts
C58-C64 = CAP: Capacitor
D2 = LED-2: Typical INFRARED GaAs LED; Published: 8-Jun-2000; LatestRevisionDate: 08-Jul-2005; LatestRevisionNote: Mech Layer 1 removed.; PackageReference: LED-0; Publisher: Altium Limited
J5 = D Connector 9: Receptacle Assembly, 9 Position, Right Angle; PackageDocument: O; Positions: 9; Published: 15-Jun-2001; LatestRevisionDate: 17-Jul-2002; LatestRevisionNote: Re-released for DXP Platform.; DatasheetDocument: 1-Sep-1999; PackageReference: 788750; Publisher: Altium Limited; Orientation: Right Angle; Gender: Receptacle
R50-R68 R75 = Res Semi: Semiconductor Resistor; Value: 1K; Published: 8-Jun-2000; LatestRevisionDate: 17-Jul-2002; LatestRevisionNote: Re-released for DXP Platform.; PackageReference: AXIAL-0.5; Publisher: Altium Limited
SW2 = SW-PB: Switch; Published: 24-Mar-1999; LatestRevisionDate: 17-Jul-2002; LatestRevisionNote: Re-released for DXP Platform.; PackageReference: SPST-2; Publisher: Altium Limited
U1 = STM32F407VGT6: as U1 on sheet MCU; DatasheetVersion: rev2, Jan-2012; PackageVersion: 2012; PackageReference: LQFP100; PackageDescription: 100-Pin Low Profile Quad Flat Package, 14x14 mm Body, 0.5 mm Pitch; ComponentLink1Description: Manufacturer URL; ComponentLink1URL: http://www.st.com/; ComponentLink2Description: STM32F405/7 Datasheet; ComponentLink2URL: http://www.st.com/internet/com/TECHNICAL_RESOURCES/TECHNICAL_LITERATURE/DATASHEET/DM00037051.pdf; ComponentLink3Description: STM32F4 Web Page; ComponentLink3URL: http://www.st.com/internet/mcu/subclass/1521.jsp
U6 U9 U12 = HCPL-060
U10 = 25AA640A-I/SN: 64K SPI Bus Serial EEPROM, 8-Pin SOIC, Industrial Temperature; FirstPublished: 29-Jan-2009; LatestRevisionDate: 02-Dec-2009; LatestRevisionNote: Updated to datasheet revision D, Jan-2008; DatasheetVersion: revD, Oct-2008; PackageVersion: revBB, Aug-2009; PackageReference: SOIC-SN8; Publisher: Altium Limited; PackageDescription: 8-Lead Plastic Small Outline (SN) - Narrow, 3.90mm Body [SOIC]; Supplier 1: Digi-Key; Supplier Part Number 1: 25AA640A-I/SN-ND; Supplier 2: Newark; Supplier Part Number 2: 27M1299; Code_JEDEC: MS-012; Code_IPC: SOIC127P600-8; ComponentLink1Description: Datasheet; ComponentLink1URL: http://ww1.microchip.com/downloads/en/DeviceDoc/21830D.pdf
U11 = MAX485ESA: Low-Power, Slew-Rate-Limited RS-485/RS-422 Transceiver; Published: 16-Jan-2001; LatestRevisionDate: 13-Apr-2006; LatestRevisionNote: IPC-7351 Footprint Added.; DatasheetVersion: Feb-1996; PackageReference: NSO8; Publisher: Altium Limited; PackageDescription: 8-Pin Small Outline Integrated Circuit 1.27 mm Pitch; Code_JEDEC: MS-012-AA; Code_IPC: SOIC127P600-8; ComponentLink1Description: Manufacturer Link; ComponentLink1URL: http://www.maxim-ic.com/; ComponentLink2Description: Datasheet; ComponentLink2URL: http://pdfserv.maxim-ic.com/en/ds/MAX1487-MAX491.pdf

## Sheet Power.SchDoc
size A4; PageSetup: Record=PageOptions嶤enterHorizontal=True嶤enterVertical=True嶱rintScale=0.98嶺Correction=1.00嶻Correction=1.00嶱rintKind=0嶣orderSize=5000000嶭eftOffset=0嶣ottomOffset=0嶰rientation=2嶱aperLength=1000嶱aperWidth=1000嶴cale=100嶱aperSource=7嶱rintQuality=-4嶮ediaType=1嶥itherType=10嶱aperKind=信纸嶱rintScaleMode=1
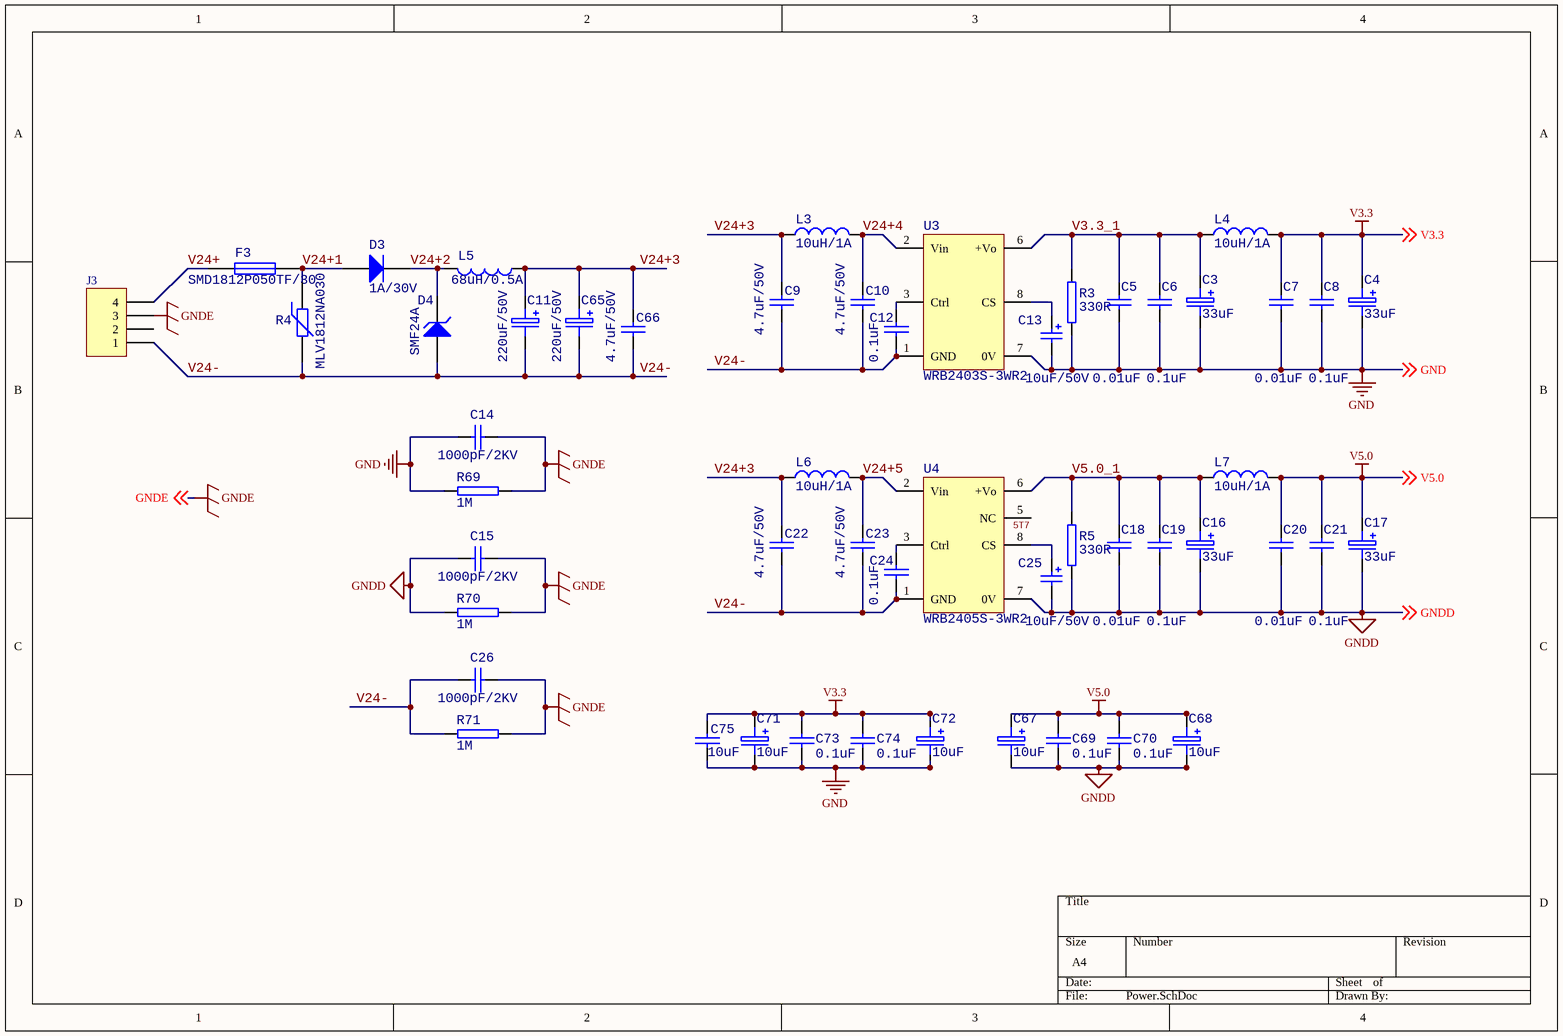
[diagram p3: Power.SchDoc]

### Parts
C3  33uF  [C3528(B)]
C4  33uF  [C3528(B)]
C5  0.01uF  [C1608(0603)]
C6  0.1uF  [C1608(0603)]
C7  0.01uF  [C1608(0603)]
C8  0.1uF  [C1608(0603)]
C9  4.7uF/50V  [C2012(0805)]
C10  4.7uF/50V  [C2012(0805)]
C11  220uF/50V  [CAPMP10X120]
C12  0.1uF  [C1608(0603)]
C13  10uF/50V  [C3216(1206)]
C14  1000pF/2KV  [C3216(1206)]
C15  1000pF/2KV  [C3216(1206)]
C16  33uF  [C3528(B)]
C17  33uF  [C3528(B)]
C18  0.01uF  [C1608(0603)]
C19  0.1uF  [C1608(0603)]
C20  0.01uF  [C1608(0603)]
C21  0.1uF  [C1608(0603)]
C22  4.7uF/50V  [C2012(0805)]
C23  4.7uF/50V  [C2012(0805)]
C24  0.1uF  [C1608(0603)]
C25  10uF/50V  [C3216(1206)]
C26  1000pF/2KV  [C3216(1206)]
C65  220uF/50V  [CAPMP10X120]
C66  4.7uF/50V  [C2012(0805)]
C67  10uF  [C3216(A)]
C68  10uF  [C3216(A)]
C69  0.1uF  [C1608(0603)]
C70  0.1uF  [C1608(0603)]
C71  10uF  [C3216(A)]
C72  10uF  [C3216(A)]
C73  0.1uF  [C1608(0603)]
C74  0.1uF  [C1608(0603)]
C75  10uF  [C2012(0805)]
D3  1A/30V  [SOD323]
D4  SMF24A  [SOD123]
F3  SMD1812P050TF/30  [R4532(1812)]
J3  Header 4  [MSTBO2.5/4-G1R]  (value not drawn)
L3  10uH/1A  [L4040]
L4  10uH/1A  [L4040]
L5  68uH/0.5A  [L4040]
L6  10uH/1A  [L4040]
L7  10uH/1A  [L4040]
R3  330R  [R3216(1206)]
R4  MLV1812NA030  [R4532(1812)]
R5  330R  [R3216(1206)]
R69  1M  [R3216(1206)]
R70  1M  [R3216(1206)]
R71  1M  [R3216(1206)]
U3  WRB2403S-3WR2  [SIP8]
U4  WRB2405S-3WR2  [SIP8]

### Nets
GND: C3.2 C4.2 C5.1 C6.1 C7.1 C8.1 C13.2 C14.1 C71.2 C72.2 C73.1 C74.1 C75.1 R3.2 R69.1 U3.7(0V) ; off-sheet GND
GNDD: C15.1 C16.2 C17.2 C18.1 C19.1 C20.1 C21.1 C25.2 C67.2 C68.2 C69.1 C70.1 R5.2 R70.1 U4.7(0V) ; off-sheet GNDD
GNDE: C14.2 C15.2 C26.2 J3.3 R69.2 R70.2 R71.2 ; off-sheet GNDE
V3.3: C4.1 C7.2 C8.2 C71.1 C72.1 C73.2 C74.2 C75.2 L4.2 ; off-sheet V3.3
V5.0: C17.1 C20.2 C21.2 C67.1 C68.1 C69.2 C70.2 L7.2 ; off-sheet V5.0
5T7: U4.5(NC)
V3.3_1: C3.1 C5.2 C6.2 L4.1 R3.1 U3.6(+Vo)
V5.0_1: C16.1 C18.2 C19.2 L7.1 R5.1 U4.6(+Vo)
V24+: F3.1 J3.4
V24+1: D3.1(A) F3.2 R4.1
V24+2: D3.2(K) D4.2(K) L5.2
V24+3: C9.2 C11.1 C22.2 C65.1 C66.2 L3.1 L5.1 L6.1
V24+4: C10.2 L3.2 U3.2(Vin)
V24+5: C23.2 L6.2 U4.2(Vin)
V24-: C9.1 C10.1 C11.2 C12.2 C22.1 C23.1 C24.2 C26.1 C65.2 C66.1 D4.1(A) J3.1 R4.2 R71.1 U3.1(GND) U4.1(GND)
NetC12_1: C12.1 U3.3(Ctrl)
NetC13_1: C13.1 U3.8(CS)
NetC24_1: C24.1 U4.3(Ctrl)
NetC25_1: C25.1 U4.8(CS)

Not connected (* = marked no-connect by the designer): J3 2; U3 5(NC)

### Library data of the parts
C3 C4 C11 C16 C17 C65 C67 C68 C71 C72 = CAPACITOR POL: CA45-?V?uF ABCD 16V10UF[A型3210]16V22UF(B型1210) 16V47UF(C型1812)
C5-C10 C12 C14 C15 C18-C24 C26 C66 C69 C70 C73-C75 = CAP: Capacitor
C13 C25 = Cap Pol2: as C37 on sheet Ethernet; Published: 8-Jun-2000; LatestRevisionDate: 17-Jul-2002; LatestRevisionNote: Re-released for DXP Platform.; PackageReference: POLAR0.8; Publisher: Altium Limited
D3 = Diode: Default Diode; Published: 8-Jun-2000; LatestRevisionDate: 17-Jul-2002; LatestRevisionNote: Re-released for DXP Platform.; PackageVersion: Sep-1996; PackageReference: SMC; Publisher: Altium Limited; Code_JEDEC: DO-214-AB
D4 = D Zener: Zener Diode; Published: 8-Jun-2000; LatestRevisionDate: 17-Jul-2002; LatestRevisionNote: Re-released for DXP Platform.; PackageReference: DIODE-0.7; Publisher: Altium Limited
F3 = FUSE1: Fuse
J3 = Header 4: Header, 4-Pin; LatestRevisionDate: 17-Jul-2002; LatestRevisionNote: Re-released for DXP Platform.; Publisher: Altium Limited
L3 L4 L6 L7 = Inductor: Code_IEC: 1005; Value: ABRACON; Published: 8-Jun-2000; LatestRevisionDate: 29-May-2009; LatestRevisionNote: IPC-7351 Footprint Added.; PackageReference: 0402-A; Publisher: Altium Limited; PackageDescription: Chip Inductor; Code_JEITA: 0402
L5 = Inductor: Code_IEC: 1005; Value: SRN4018-680M/CD32-680K; Published: 8-Jun-2000; LatestRevisionDate: 29-May-2009; LatestRevisionNote: IPC-7351 Footprint Added.; PackageReference: 0402-A; Publisher: Altium Limited; PackageDescription: Chip Inductor; Code_JEITA: 0402
R3 R5 R69-R71 = R
R4 = Res Varistor: Varistor (Voltage-Sensitive Resistor); Published: 24-Mar-1999; LatestRevisionDate: 29-May-2009; LatestRevisionNote: IPC-7351 Footprint Added.; PackageVersion: Mar-2003; PackageReference: 6-0805; Publisher: Altium Limited; PackageDescription: Chip Resistor 0805 Case Size; Code_IPC: RESC2012
U3 U4 = WRA_S-1WR2

## Nets that join several sheets
GND: Ethernet (19 pins), MCU (33 pins), MCU_1 (6 pins), Power (16 pins)
GNDD: MCU_1 (14 pins), Power (15 pins)
GNDE: Ethernet (J4.13 J4.14), MCU_1 (J5.1 J5.10 J5.11), Power (7 pins)
V3.3: Ethernet (25 pins), MCU (21 pins), MCU_1 (14 pins), Power (9 pins)
V5.0: MCU_1 (19 pins), Power (8 pins)
PA0: Ethernet (R28.2), MCU_1 (U1.23)
PA1: Ethernet (R18.2), MCU_1 (U1.24)
PA2: Ethernet (R32.2), MCU_1 (U1.25)
PA3: Ethernet (R27.2), MCU_1 (U1.26)
PA7: Ethernet (R21.2), MCU_1 (U1.32)
PA8: Ethernet (R39.2), MCU_1 (U1.67)
PA9: MCU (J1.7), MCU_1 (U1.68)
PA10: MCU (J1.9), MCU_1 (U1.69)
PA13: MCU (J1.8 R48.2), MCU_1 (U1.72)
PA14: MCU (J1.6 R49.2), MCU_1 (U1.76)
PB0: Ethernet (R14.2), MCU_1 (U1.35)
PB1: Ethernet (R16.2), MCU_1 (U1.36)
PB2: MCU (R44.2), MCU_1 (U1.37)
PB8: Ethernet (R11.2), MCU_1 (U1.95)
PB10: Ethernet (R17.2), MCU_1 (U1.47)
PB11: Ethernet (R7.2), MCU_1 (U1.48)
PB12: Ethernet (R8.2), MCU_1 (U1.51)
PB13: Ethernet (R9.2), MCU_1 (U1.52)
PC1: Ethernet (R30.2), MCU (U1.16)
PC2: Ethernet (R10.2), MCU (U1.17)
PC3: Ethernet (R6.2), MCU (U1.18)
PC4: Ethernet (R12.2), MCU (U1.33)
PC5: Ethernet (R13.2), MCU (U1.34)
PC6: MCU (U1.63), MCU_1 (U9.3)
PC7: MCU (U1.64), MCU_1 (R65.1 R68.2 U12.6)
PC8: MCU (U1.65), MCU_1 (R68.1)
PC9: MCU (U1.66), MCU_1 (U6.2)
PC10: Ethernet (R37.2), MCU (U1.78)
PD8: MCU (U1.55), MCU_1 (R50.1)
PD9: MCU (U1.56), MCU_1 (R51.1)
RST#: Ethernet (R36.2), MCU (C48.1 R46.1 R47.2 U1.14)